# EAGLE design Relay driver (EAGLE 7.2.0)
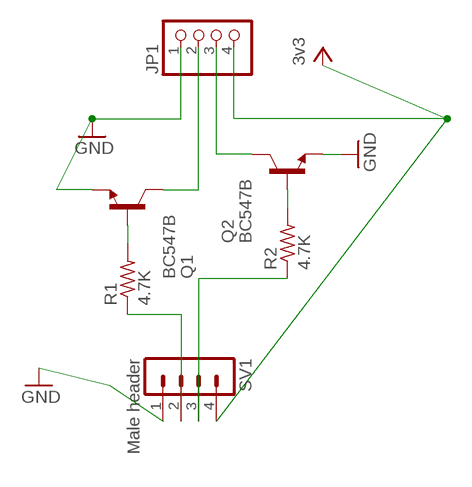
[diagram p0: schematic, sheet 1]

## Parts
JP1  PINHD-1X4  [1X04]
Q1  BC547B  [TO92]
Q2  BC547B  [TO92]
R1  4.7K  R-US_0204/5  [0204/5]
R2  4.7K  R-US_0204/5  [0204/5]
SV1  Male header  MA04-1  [MA04-1]

## Nets
GND: JP1.1 Q1.1(E) Q2.1(E) SV1.1
N$1: Q1.2(B) R1.2
N$2: Q2.2(B) R2.2
N$3: R1.1 SV1.2
N$4: R2.1 SV1.3
N$5: JP1.2 Q1.3(C)
N$6: JP1.3 Q2.3(C)
VCC: JP1.4 SV1.4 ; supply symbol labelled 3v3

## Library data of the parts
JP1 = pinhead:PINHD-1X4: PIN HEADER
Q1 Q2 = transistor-npn:BC547*: NPN Transistor
R1 R2 = resistor:R-US_: RESISTOR, American symbol
SV1 = con-lstb:MA04-1: PIN HEADER; OC_FARNELL: unknown; OC_NEWARK: unknown

## Board
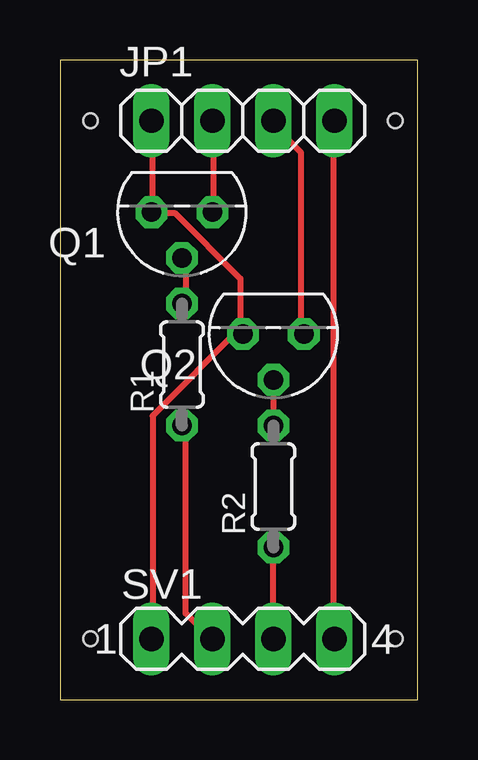
[diagram p1: board, top side]

Size 14.91 x 26.66 mm. Coordinates in mm from the lower left corner, seen from the top.
Outline: 0,0 14.91,0 14.91,26.66 0,26.66 0,0
Copper layers (1*16): Top 0.035mm / dielectric 1.5mm / Bottom 0.035mm
Design rules "default": minimum track width 10mil, minimum drill 24mil, track to track 8mil, track to pad 8mil, pad to pad 8mil, via to via 8mil, smd to smd 8mil, copper to edge 40mil, drill to drill 8mil, minimum pad ring 10mil, minimum via ring 8mil, stop-mask expansion 4mil, vias tented up to drill 0mil, thermal gap 10mil
Holes 0.6 mm at 1.27,24.13 13.97,24.13 13.97,2.54 1.27,2.54

### Footprints (pad centres in the part's own frame; a part is rotated, then mirrored left to right if it is on the bottom)
1X04 = drill 1.016 long: 1 -3.81,0; 2 -1.27,0; 3 1.27,0; 4 3.81,0
TO92 = drill 0.813 octagon: 1 1.27,0; 2 0,1.905; 3 -1.27,0
0204/5 = drill 0.813 octagon: 1 -2.54,0; 2 2.54,0
MA04-1 = drill 1.016 long: 1 -3.81,0; 2 -1.27,0; 3 1.27,0; 4 3.81,0

### Placement (x,y rotation side)
JP1  7.62,24.13 0 top
Q1  5.08,20.32 180 top
Q2  8.89,15.24 180 top
R1  5.08,13.97 90 top
R2  8.89,8.89 90 top
SV1  7.62,2.54 0 top

### Tracks (layer width: path | path; a pad name or v marks a point on that pad's centre or on a via)
GND
  Top 0.254: 7.52,15.49 7.52,17.55 4.78,20.29 3.86,20.29 Q1.1 3.86,20.52 3.86,23.95 JP1.1 | 7.52,15.49 7.52,15.26 Q2.1 7.52,15.49 | 7.52,15.49 3.86,11.84 3.86,2.69 SV1.1
N$1
  Top 0.254: R1.2 5.23,16.64 5.23,18.24 Q1.2
N$2
  Top 0.254: Q2.2 R2.2
N$3
  Top 0.254: R1.1 5.23,11.38 5.23,3.61 6.15,2.69 SV1.2
N$4
  Top 0.254: SV1.3 R2.1
N$5
  Top 0.254: Q1.3 6.37,20.52 6.37,23.95 JP1.2
N$6
  Top 0.254: Q2.3 10.03,15.26 10.03,22.81 8.89,23.95 JP1.3
VCC
  Top 0.254: SV1.4 11.4,2.69 11.4,23.95 JP1.4